# EAGLE design door_control (EAGLE 9.3.0)
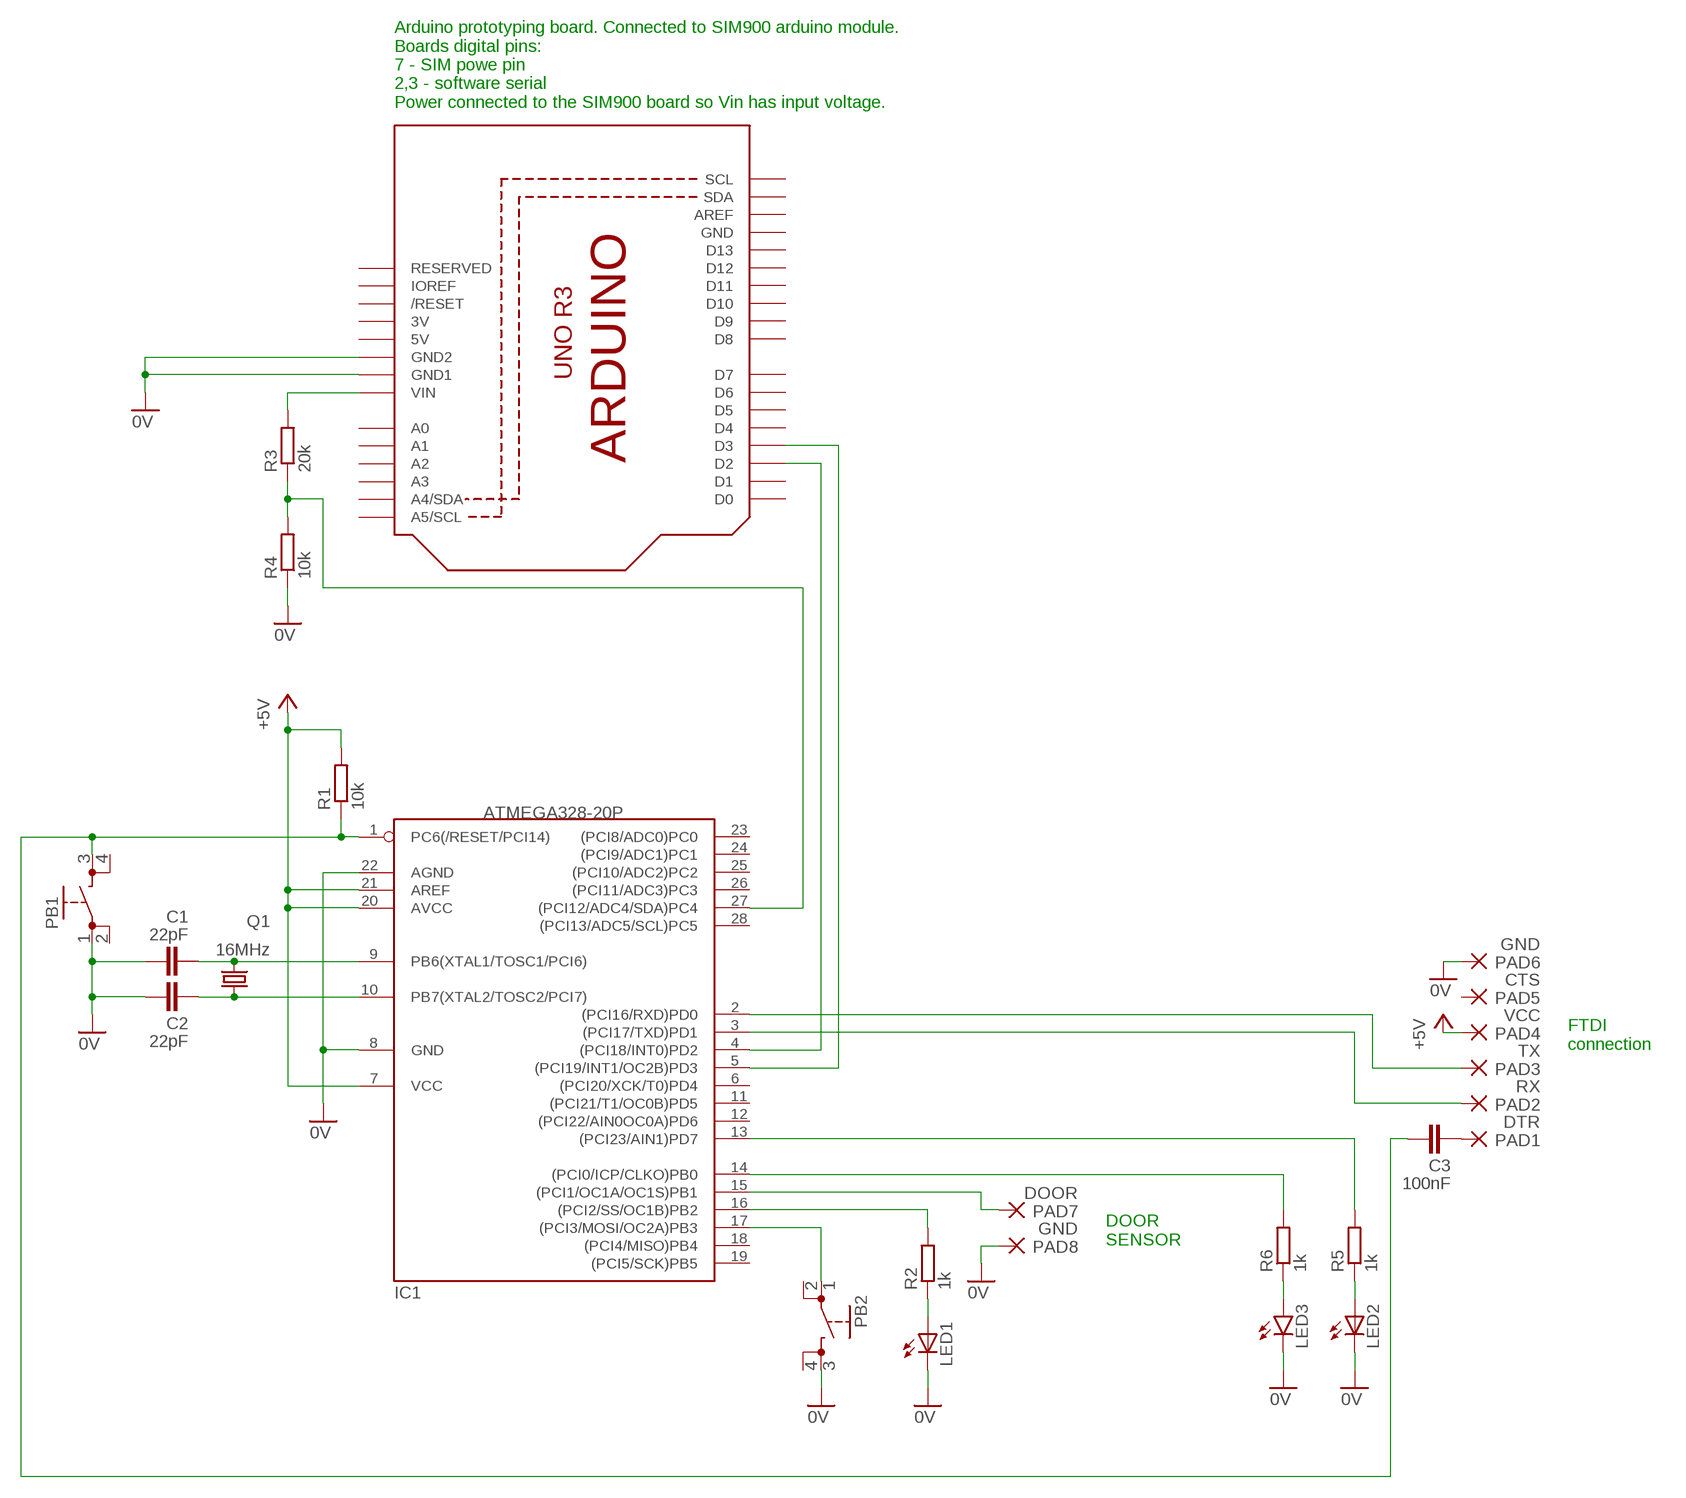
[diagram p0: schematic, sheet 1]

## Parts
C1  22pF  C5/2.5  [C5B2.5]
C2  22pF  C5/2.5  [C5B2.5]
C3  100nF  C10/4  [C10B4]
IC1  ATMEGA328-20P  [DIL28-3]
LED1  LED_ELD260  [LED_LD260]
LED2  LED_ELD260  [LED_LD260]
LED3  LED5MM  [LED5MM]
PAD1  DTR  1,6/0,9  [1,6/0,9]
PAD2  RX  1,6/0,9  [1,6/0,9]
PAD3  TX  1,6/0,9  [1,6/0,9]
PAD4  VCC  1,6/0,9  [1,6/0,9]
PAD5  CTS  1,6/0,9  [1,6/0,9]
PAD6  GND  1,6/0,9  [1,6/0,9]
PAD7  DOOR  1,6/0,9  [1,6/0,9]
PAD8  GND  1,6/0,9  [1,6/0,9]
PB1  4P_BUTTONTH  [4P_BUTTON]
PB2  4P_BUTTONTH  [4P_BUTTON]
Q1  16MHz  CRYSTALHC49S  [HC49/S]
R1  10k  R-EU_0207/10  [0207/10]
R2  1k  R-EU_0204/5  [0204/5]
R3  20k  R-EU_0204/5  [0204/5]
R4  10k  R-EU_0204/5  [0204/5]
R5  1k  R-EU_0204/5  [0204/5]
R6  1k  R-EU_0204/5  [0204/5]
U1  ARDUINOR3-DIMENSION  [ARDUINOR3]

## Nets
0V: C1.1 C2.1 IC1.8(GND) IC1.22(AGND) LED1.K(C) LED2.K(C) LED3.K(C) PAD6.1(P) PAD8.1(P) PB1.1 PB2.3 R4.1 U1.GND1 U1.GND2
+5V: IC1.7(VCC) IC1.20(AVCC) IC1.21(AREF) PAD4.1(P) R1.2
N$1: C1.2 IC1.9(PB6(XTAL1/TOSC1/PCI6)) Q1.2
N$2: C2.2 IC1.10(PB7(XTAL2/TOSC2/PCI7)) Q1.1
N$3: C3.1 IC1.1(PC6(/RESET/PCI14)) PB1.3 R1.1
N$4: IC1.3((PCI17/TXD)PD1) PAD2.1(P)
N$5: IC1.2((PCI16/RXD)PD0) PAD3.1(P)
N$6: C3.2 PAD1.1(P)
N$7: IC1.15((PCI1/OC1A/OC1S)PB1) PAD7.1(P)
N$8: LED1.A R2.1
N$9: IC1.4((PCI18/INT0)PD2) U1.D2
N$10: IC1.17((PCI3/MOSI/OC2A)PB3) PB2.1
N$11: IC1.5((PCI19/INT1/OC2B)PD3) U1.D3
N$12: IC1.27((PCI12/ADC4/SDA)PC4) R3.1 R4.2
N$13: R3.2 U1.VIN
N$15: IC1.13((PCI23/AIN1)PD7) R5.2
N$16: LED2.A R5.1
N$17: IC1.14((PCI0/ICP/CLKO)PB0) R6.2
N$18: LED3.A R6.1
N$19: IC1.16((PCI2/SS/OC1B)PB2) R2.2
Unconnected: IC1.6((PCI20/XCK/T0)PD4) IC1.11((PCI21/T1/OC0B)PD5) IC1.12((PCI22/AIN0OC0A)PD6) IC1.18((PCI4/MISO)PB4) IC1.19((PCI5/SCK)PB5) IC1.23((PCI8/ADC0)PC0) IC1.24((PCI9/ADC1)PC1) IC1.25((PCI10/ADC2)PC2) IC1.26((PCI11/ADC3)PC3) IC1.28((PCI13/ADC5/SCL)PC5) PAD5.1(P) PB1.2 PB1.4 PB2.2 PB2.4 U1.A0 U1.A1 U1.A2 U1.A3 U1.A4(A4/SDA) U1.A5(A5/SCL) U1.AREF U1.D0 U1.D1 U1.D4 U1.D5 U1.D6 U1.D7 U1.D8 U1.D9 U1.D10 U1.D11 U1.D12 U1.D13 U1.IOREF U1.RESERVED U1.RESET(/RESET) U1.SCL U1.SDA

## Notes on the sheet
- Arduino prototyping board. Connected to SIM900 arduino module.
  Boards digital pins:
  7 - SIM powe pin
  2,3 - software serial
  Power connected to the SIM900 board so Vin has input voltage.
- FTDI
  connection
- DOOR
  SENSOR

## Power pins joined to a net without a drawn wire
3V: U1.3V
5V: U1.5V
GND: U1.GND

## Library data of the parts
C1-C3 = capacitor-wima:C: CAPACITOR naming: grid - package width
IC1 = atmega328:ATMEGA328*P: MICROCONTROLLER 32 kBytes FLASH 2 kBytes SRAM 1 kBytes EEPROM USART 8-channel 10 bit ADC
LED1 LED2 = eagle-ltspice:LED_E: LED Source: http://www.osram.convergy.de Source: www.luxeon.com Source: www.kingbright.com; SPICEMODEL: NONE; SPICEPREFIX: D; SPICETYPE: diode
LED3 = led:LED: LED OSRAM: - CHIPLED LG R971, LG N971, LY N971, LG Q971, LY Q971, LO R971, LY R971 LH N974, LH R974 LS Q976, LO Q976, LY Q976 LO Q996 - Hyper CHIPLED LW Q18S LB Q993, LB Q99A, LB R99A - SideLED LS A670, LO A670, LY A670, LG A670, LP A670 LB A673, LV A673, LT A673, LW A673 LH A674 LY A675 LS A676, LA A676, LO A676, LY A676, LW A676 LS A679, LY A679, LG A679 - Hyper Micro SIDELED® LS Y876, LA Y876, LO Y876, LY Y876 LT Y87S - SmartLED LW L88C, LW L88S LB L89C, LB L89S, LG L890 LS L89K, LO L89K, LY L89K LS L896, LA L896, LO L896, LY L896 - TOPLED LS T670, LO T670, LY T670, LG T670, LP T670 LSG T670, LSP T670, LSY T670, LOP T670, LYG T670 LG T671, LOG T671, LSG T671 LB T673, LV T673, LT T673, LW T673 LH T674 LS T676, LA T676, LO T676, LY T676, LB T676, LH T676, LSB T676, LW T676 LB T67C, LV T67C, LT T67C, LS T67K, LO T67K, LY T67K, LW E67C LS E67B, LA E67B, LO E67B, LY E67B, LB E67C, LV E67C, LT E67C LW T67C LS T679, LY T679, LG T679 LS T770, LO T770, LY T770, LG T770, LP T770 LB T773, LV T773, LT T773, LW T773 LH T774 LS E675, LA E675, LY E675, LS T675 LS T776, LA T776, LO T776, LY T776, LB T776 LHGB T686 LT T68C, LB T68C - Hyper Mini TOPLED® LB M676 - Mini TOPLED Santana® LG M470 LS M47K, LO M47K, LY M47K Source: http://www.osram.convergy.de LUXEON: - LUMILED® LXK2-PW12-R00, LXK2-PW12-S00, LXK2-PW14-U00, LXK2-PW14-V00 LXK2-PM12-R00, LXK2-PM12-S00, LXK2-PM14-U00 LXK2-PE12-Q00, LXK2-PE12-R00, LXK2-PE12-S00, LXK2-PE14-T00, LXK2-PE14-U00 LXK2-PB12-K00, LXK2-PB12-L00, LXK2-PB12-M00, LXK2-PB14-N00, LXK2-PB14-P00, LXK2-PB14-Q00 LXK2-PR12-L00, LXK2-PR12-M00, LXK2-PR14-Q00, LXK2-PR14-R00 LXK2-PD12-Q00, LXK2-PD12-R00, LXK2-PD12-S00 LXK2-PH12-R00, LXK2-PH12-S00 LXK2-PL12-P00, LXK2-PL12-Q00, LXK2-PL12-R00 Source: www.luxeon.com KINGBRIGHT: KA-3528ASYC Source: www.kingbright.com
PAD1-PAD8 = wirepad:1,6/0,9: THROUGH-HOLE PAD
PB1 PB2 = ib_library:4P_BUTTON: Button on Arduino board
Q1 = crystal:CRYSTAL: CRYSTAL; OC_FARNELL: 1667008; OC_NEWARK: unknown
R1-R6 = rcl:R-EU_: RESISTOR, European symbol; SPICEPREFIX: R
U1 = adafruit:ARDUINOR3: This is a new object for the new Arduino R3 - with extra pins that you may want to use (such as IOref, and duplicated A4/A5

## Board
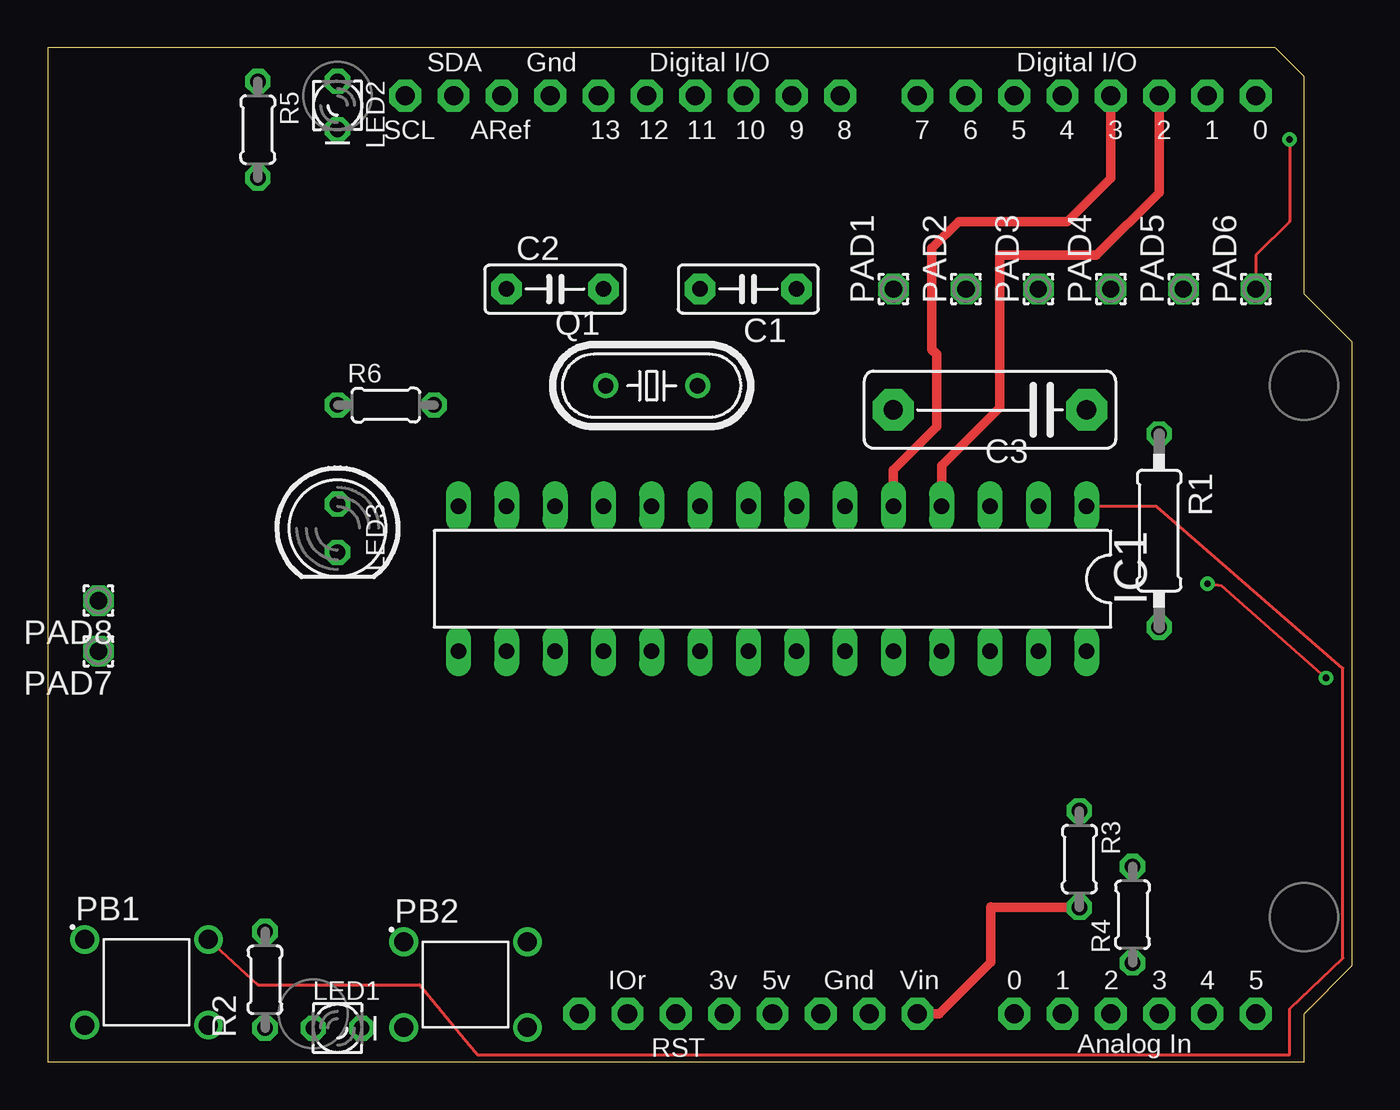
[diagram p1: board, top side]
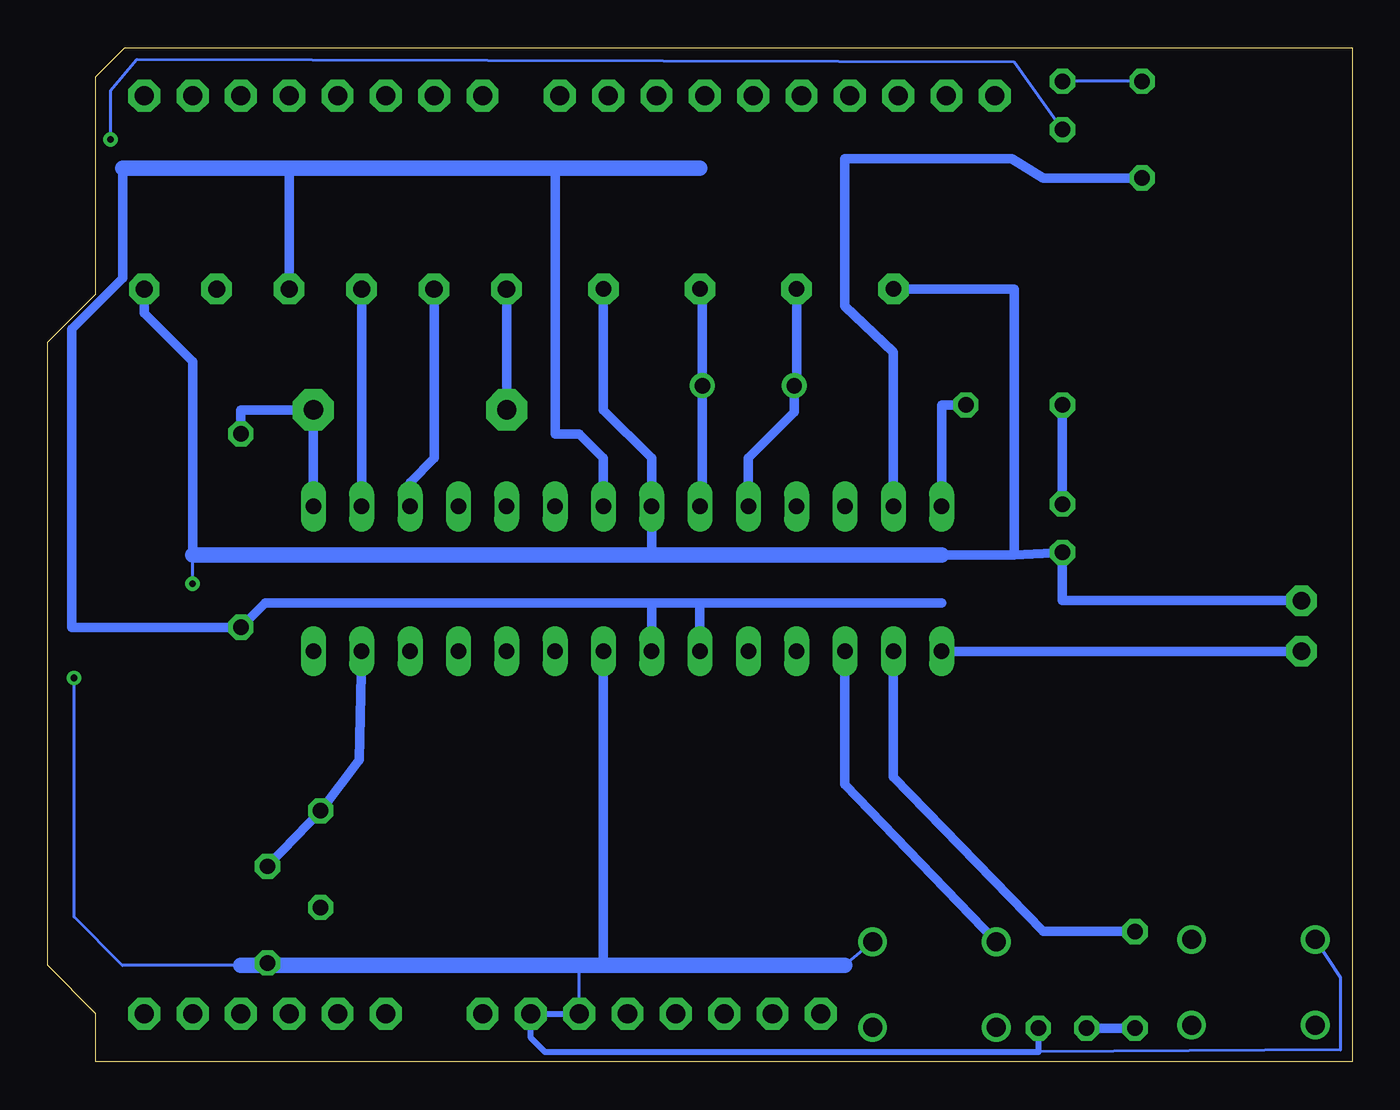
[diagram p2: board, bottom side, seen from below]

Size 68.58 x 53.34 mm. Coordinates in mm from the lower left corner, seen from the top.
Copper layers (1*16): Top 0.035mm / dielectric 1.5mm / Bottom 0.035mm
Design rules "default": minimum track width 6mil, minimum drill 0.35mm, track to track 6mil, track to pad 6mil, pad to pad 6mil, via to via 6mil, smd to smd 6mil, copper to edge 40mil, drill to drill 6mil, minimum pad ring 10mil, minimum via ring 8mil, stop-mask expansion 4mil, vias tented up to drill 0mil, thermal gap 10mil

### Footprints (pad centres in the part's own frame; a part is rotated, then mirrored left to right if it is on the bottom)
C5B2.5 = drill 0.813 pad 1.6 octagon: 1 -2.54,0; 2 2.54,0
C10B4 = drill 1.016 pad 2.159 octagon: 1 -5.08,0; 2 5.08,0
DIL28-3 = drill 0.813 long: 1 -16.51,-3.81; 2 -13.97,-3.81; 3 -11.43,-3.81; 4 -8.89,-3.81; 5 -6.35,-3.81; 6 -3.81,-3.81; 7 -1.27,-3.81; 8 1.27,-3.81; 9 3.81,-3.81; 10 6.35,-3.81; 11 8.89,-3.81; 12 11.43,-3.81; 13 13.97,-3.81; 14 16.51,-3.81; 15 16.51,3.81; 16 13.97,3.81; 17 11.43,3.81; 18 8.89,3.81; 19 6.35,3.81; 20 3.81,3.81; 21 1.27,3.81; 22 -1.27,3.81; 23 -3.81,3.81; 24 -6.35,3.81; 25 -8.89,3.81; 26 -11.43,3.81; 27 -13.97,3.81; 28 -16.51,3.81
LED_LD260 = drill 0.813 octagon: A -1.27,0; K 1.27,0
LED5MM = drill 0.813 octagon: A -1.27,0; K 1.27,0
1,6/0,9 = drill 0.914 pad 1.6 octagon: 1 0,0
4P_BUTTON = drill 1: 1 -3.25,2.25; 2 -3.25,-2.25; 3 3.25,2.25; 4 3.25,-2.25
HC49/S = drill 0.813: 1 -2.413,0; 2 2.413,0
0207/10 = drill 0.813 octagon: 1 -5.08,0; 2 5.08,0
0204/5 = drill 0.813 octagon: 1 -2.54,0; 2 2.54,0
ARDUINOR3 = drill 1 pad 1.676 octagon: 3V 35.56,2.54; 5V 38.1,2.54; A0 50.8,2.54; A1 53.34,2.54; A2 55.88,2.54; A3 58.42,2.54; A4 60.96,2.54; A5 63.5,2.54; AREF 23.876,50.8; D0 63.5,50.8; D1 60.96,50.8; D2 58.42,50.8; D3 55.88,50.8; D4 53.34,50.8; D5 50.8,50.8; D6 48.26,50.8; D7 45.72,50.8; D8 41.656,50.8; D9 39.116,50.8; D10 36.576,50.8; D11 34.036,50.8; D12 31.496,50.8; D13 28.956,50.8; GND 26.416,50.8; GND1 43.18,2.54; GND2 40.64,2.54; IOREF 30.48,2.54; RESERVED 27.94,2.54; RESET 33.02,2.54; SCL 18.796,50.8; SDA 21.336,50.8; VIN 45.72,2.54

### Placement (x,y rotation side)
C1  36.83,40.64 180 top
C2  26.67,40.64 0 top
C3  49.53,34.29 180 top
IC1  38.1,25.4 180 top
LED1  15.24,1.78 0 top
LED2  15.24,50.29 270 top
LED3  15.24,28.07 270 top
PAD1  44.45,40.64 90 top
PAD2  48.26,40.64 90 top
PAD3  52.07,40.64 90 top
PAD4  55.88,40.64 90 top
PAD5  59.69,40.64 90 top
PAD6  63.5,40.64 90 top
PAD7  2.67,21.59 180 top
PAD8  2.67,24.26 180 top
PB1  5.21,4.19 0 top
PB2  21.97,4.06 0 top
Q1  31.75,35.56 0 top
R1  58.42,27.94 270 top
R2  11.43,4.32 90 top
R3  54.23,10.67 270 top
R4  57.02,7.75 90 top
R5  11.05,49.02 270 top
R6  17.78,34.54 0 top
U1  0,0 0 top

### Tracks (layer width: path | path; a pad name or v marks a point on that pad's centre or on a via)
0V  (via drill 0.35)
  Top 0.15: v65.28,48.51 65.28,44.2 63.5,42.42 PAD6.1 | v67.18,20.19 61.72,25.02 v60.96,25.15
  Bottom 0.15: LED2.K 17.78,52.58 63.88,52.7 65.28,51.05 v65.28,48.51 | 58.42,5.08 64.64,5.08 67.18,7.62 v67.18,20.19 | v60.96,25.15 60.96,26.67
  Bottom 0.152: U1.GND2 40.64,5.08 | PB1.1 0.63,4.45 0.63,0.63 16.51,0.53 | 26.67,5.08 PB2.3
  Bottom 0.305: LED1.K 16.51,0.53 42.44,0.53 43.18,1.27 U1.GND1 U1.GND2
  Bottom 0.508: PAD6.1 63.5,39.37 60.96,36.83 60.96,26.67 | 36.83,26.67 IC1.8 36.83,31.75 39.37,34.29 C1.1 | C2.1 17.78,40.64 17.78,26.67 | 17.78,26.67 21.59,26.67 | IC1.22 39.37,5.08 | PAD8.1 15.24,24.26 LED3.K 17.78,26.67 | R4.1 58.29,5.21 58.42,5.08
  Bottom 0.813: 60.96,26.67 36.83,26.67 21.59,26.67 | 26.67,5.08 39.37,5.08 40.64,5.08 58.42,5.08
+5V
  Bottom 0.508: 36.83,24.13 57.15,24.13 R1.2 67.31,22.86 67.31,38.54 64.62,41.23 64.62,46.99 | 36.83,24.13 34.29,24.13 | 34.29,24.13 21.59,24.13 | IC1.21 36.83,24.13 | IC1.20 34.29,24.13 | PAD4.1 55.88,46.99 | IC1.7 39.37,31.75 40.64,33.02 41.91,33.02 41.91,46.99
  Bottom 0.813: 34.29,46.99 41.91,46.99 55.88,46.99 64.62,46.99
N$1
  Bottom 0.508: IC1.9 34.16,29.34 Q1.2 34.16,40.51 C1.2
N$2
  Bottom 0.508: C2.2 29.21,35.69 Q1.1 29.34,34.16 31.75,31.75 IC1.10
N$3
  Top 0.152: PB1.3 11.05,4.06 19.56,4.06 22,1.09 22.61,0.38 65.28,0.38 65.28,2.79 68.07,5.46 68.07,20.7 58.29,29.21 IC1.1
  Bottom 0.508: IC1.1 C3.1 58.42,34.29 R1.1
N$4
  Bottom 0.508: PAD2.1 48.26,31.75 49.53,30.48 IC1.3
N$5
  Bottom 0.508: IC1.2 PAD3.1
N$6
  Bottom 0.508: PAD1.1 C3.2
N$7
  Bottom 0.508: PAD7.1 IC1.15
N$8
  Bottom 0.508: R2.1 LED1.A
N$9
  Top 0.508: U1.D2 58.42,45.72 55.12,42.42 50.04,42.42 50.04,34.42 46.99,31.37 IC1.4
N$10
  Bottom 0.508: PB2.1 26.67,14.6 IC1.17
N$11
  Top 0.508: U1.D3 55.88,46.48 53.59,44.2 47.88,44.2 46.48,42.8 46.48,37.46 46.74,37.21 46.74,33.4 44.45,31.12 IC1.5
N$12
  Bottom 0.508: R4.2 56.9,10.41 R3.1 52.2,15.88 IC1.27 52.43,21.23
N$13
  Top 0.508: R3.2 49.62,8.13 49.56,8.15 49.56,5.24 46.86,2.54 U1.VIN
N$15
  Bottom 0.508: IC1.13 24.13,37.34 26.67,39.75 26.67,47.5 17.91,47.5 16.26,46.48 R5.2
N$16
  Bottom 0.15: R5.1 LED2.A
N$17
  Bottom 0.508: R6.2 21.59,34.54 IC1.14
N$18
  Bottom 0.508: LED3.A R6.1
N$19
  Bottom 0.508: IC1.16 24.13,14.99 16.26,6.86 R2.2